# EAGLE schematic Elspark v6 (EAGLE 6.5.0)
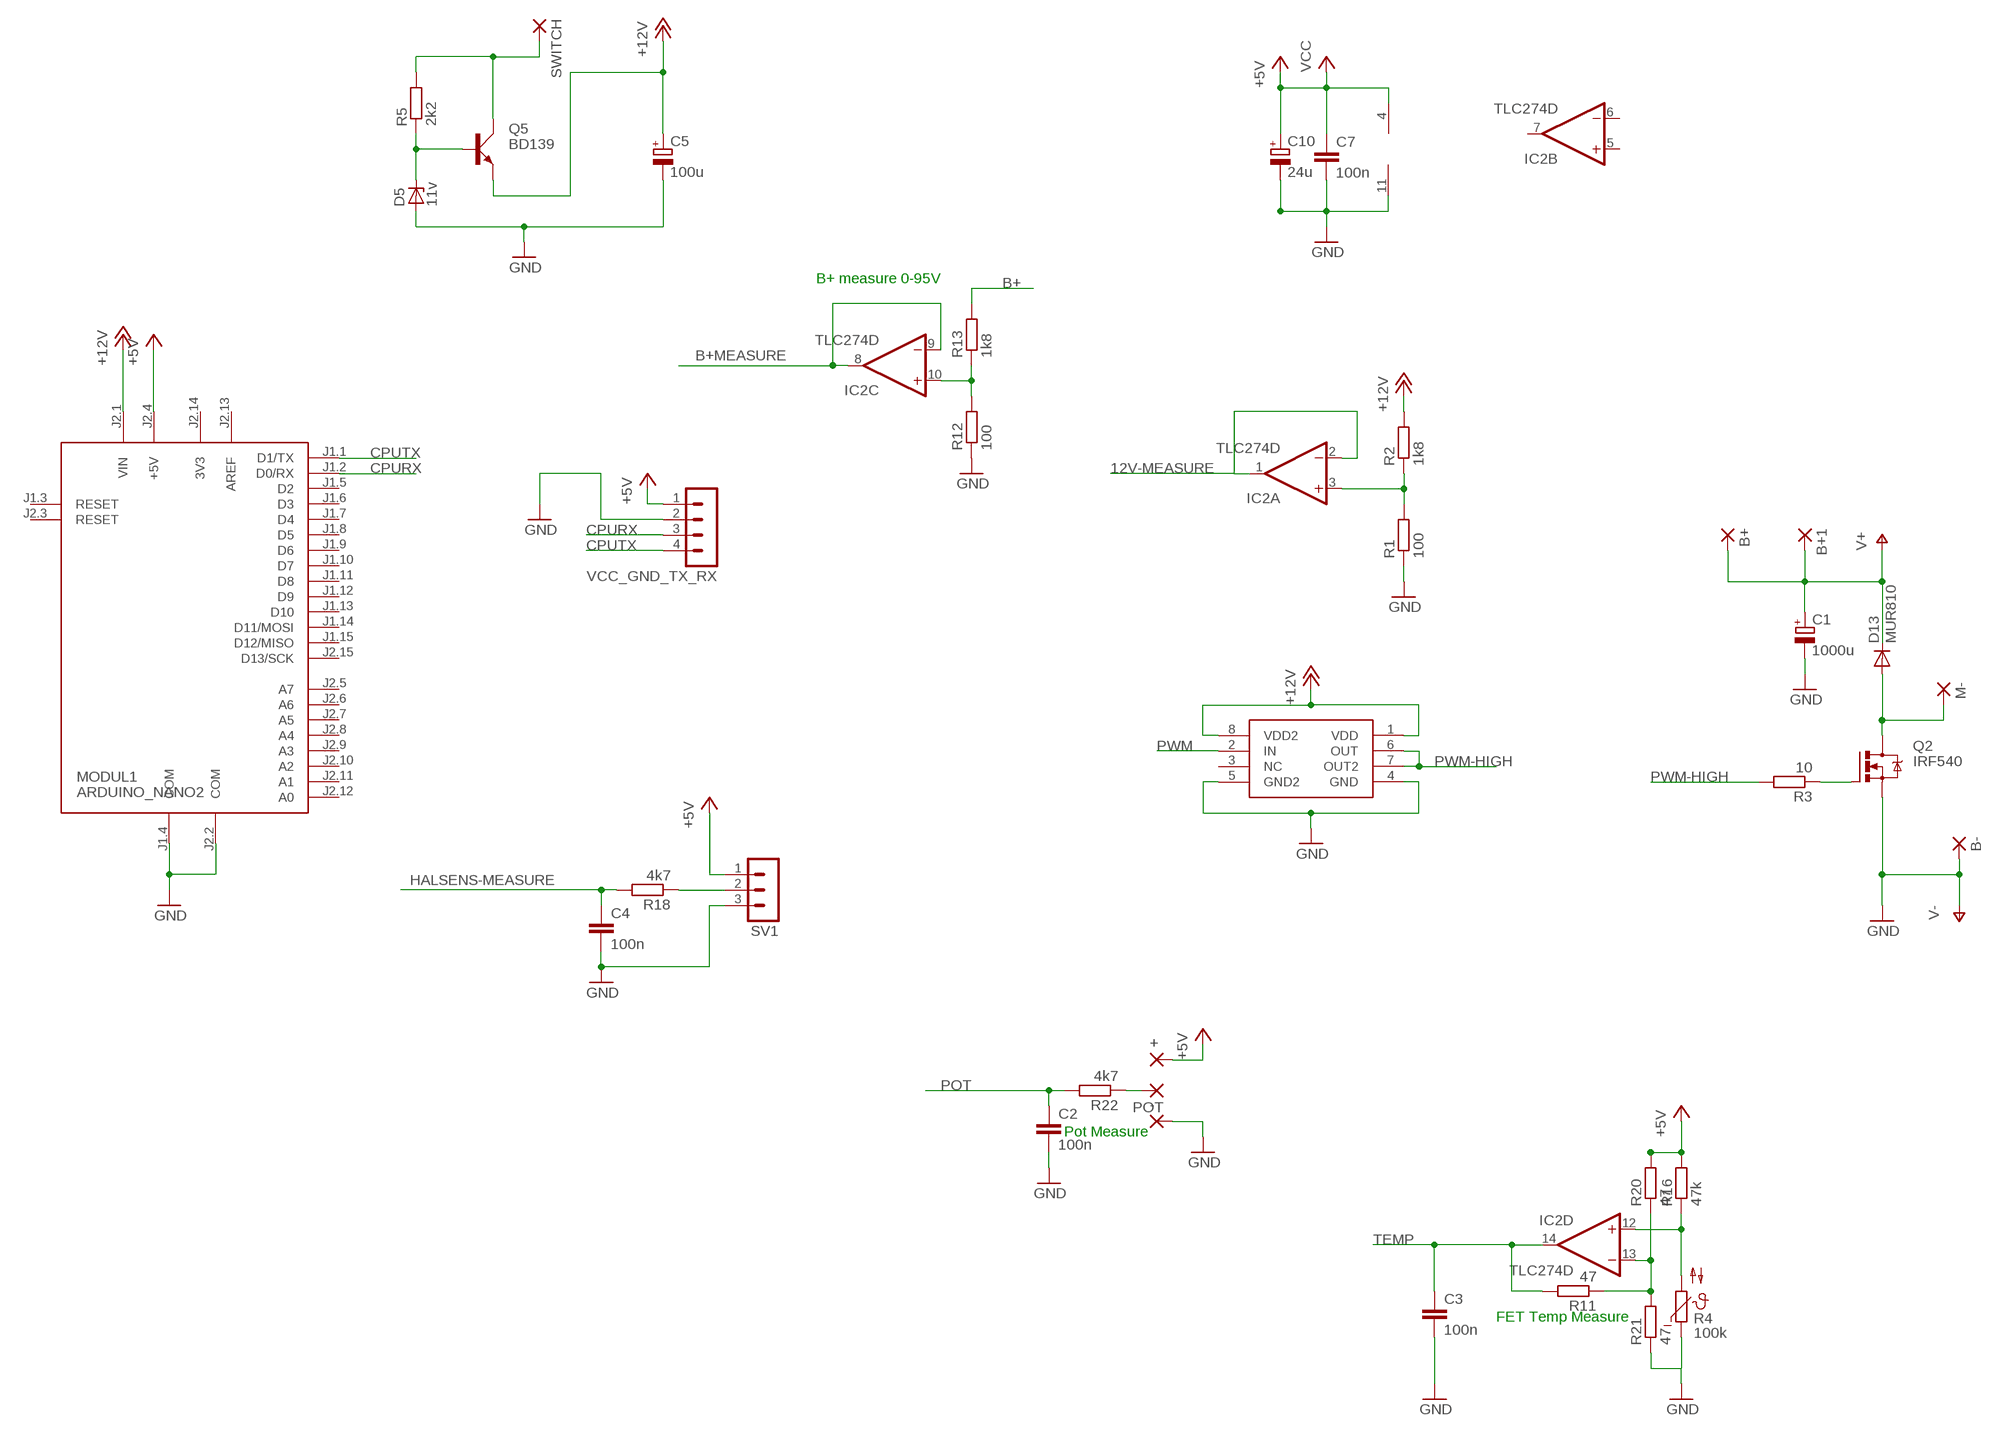
[diagram p0: schematic, sheet 1]

## Parts
+  2,15/1,0  [2,15/1,0]
-  2,15/1,0  [2,15/1,0]
B+  WIREPAD4,16O1,6  [4,16O1,6]
B+1  WIREPAD4,16O1,6  [4,16O1,6]
B-  WIREPAD4,16O1,6  [4,16O1,6]
C1  1000u  CPOL-EUE7.5-16  [E7,5-16]
C2  100n  C-EU050-024X044  [C050-024X044]
C3  100n  C-EU050-024X044  [C050-024X044]
C4  100n  C-EU050-024X044  [C050-024X044]
C5  100u  CPOL-EUE2.5-5  [E2,5-5]
C7  100n  C-EU050-024X044  [C050-024X044]
C10  24u  CPOL-EUE2.5-5  [E2,5-5]
D5  11v  BZX55  [DO35Z10]
D13  MUR810  [TO220ACS]
IC2  TLC274D  [SO14]
M-  WIREPAD4,16O1,6  [4,16O1,6]
MODUL1  ARDUINO_NANO2  [ARDUINO_NANO2]
POT  2,15/1,0  [2,15/1,0]
Q2  IRF540  [TO220BV]
Q5  BD139  [TO126AV]
R1  100  R-EU_0204/7  [0204/7]
R2  1k8  R-EU_0204/7  [0204/7]
R3  10  R-EU_0207/2V  [0207/2V]
R4  100k  NTC640-9  [N640]
R5  2k2  R-EU_0207/2V  [0207/2V]
R11  47  R-EU_0207/2V  [0207/2V]
R12  100  R-EU_0204/7  [0204/7]
R13  1k8  R-EU_0204/7  [0204/7]
R16  47k  R-EU_0207/2V  [0207/2V]
R18  4k7  R-EU_0204/7  [0204/7]
R20  47  R-EU_0207/2V  [0207/2V]
R21  47  R-EU_0207/2V  [0207/2V]
R22  4k7  R-EU_0207/2V  [0207/2V]
SV1  MA03-1  [MA03-1]
SWITCH  1,6/0,9  [1,6/0,9]
U$1  MIC4451SO-8  [SO-8]
VCC_GND_TX_RX  MA04-1  [MA04-1]

## Nets
12V-MEASURE: IC2.1(A:OUT) IC2.2(A:-IN)
+5V: MODUL1.J2.4(+5V) R16.2 R20.2 SV1.1 VCC_GND_TX_RX.1
+12V [Power]: C5.+ MODUL1.J2.1(VIN) Q5.E R2.2 U$1.1(VDD) U$1.8(VDD2)
B+ [High Power]: B+1.1(P) B+.1(P) C1.+ D13.C R13.2 ; supply symbol labelled V+
B+MEASURE: IC2.8(C:OUT) IC2.9(C:-IN)
CPURX: MODUL1.J1.2(D0/RX) VCC_GND_TX_RX.3
CPUTX: MODUL1.J1.1(D1/TX) VCC_GND_TX_RX.4
GND [Power]: -.1(P) B-.1(P) C1.- C2.2 C3.2 C4.2 C5.- C7.2 C10.- D5.A IC2.11(P:V-) MODUL1.J1.4(COM) MODUL1.J2.2(COM) Q2.S R1.1 R4.1 R12.1 R21.1 SV1.3 U$1.4(GND) U$1.5(GND2) VCC_GND_TX_RX.2 ; supply symbol labelled V-
HALSENS-MEASURE: C4.1 R18.2
M+ [High Power]: D13.A M-.1(P) Q2.D
N$2: IC2.3(A:+IN) R1.2 R2.1
N$9: Q2.G R3.1
N$10: IC2.10(C:+IN) R12.2 R13.1
N$11: D5.C Q5.B R5.1
N$17: R18.1 SV1.2
N$23: IC2.13(D:-IN) R11.1 R20.1 R21.2
N$34: POT.1(P) R22.1
N$35: IC2.12(D:+IN) R4.2 R16.1
N$41 [Power]: Q5.C R5.2 SWITCH.1(P)
POT: C2.1 R22.2
PWM: U$1.2(IN)
PWM-HIGH: R3.2 U$1.6(OUT) U$1.7(OUT2)
TEMP: C3.1 IC2.14(D:OUT) R11.2
VCC: +.1(P) C7.1 C10.+ IC2.4(P:V+) ; supply symbol labelled +5V
Unconnected: IC2.5(B:+IN) IC2.6(B:-IN) IC2.7(B:OUT) MODUL1.J1.3(RESET) MODUL1.J1.5(D2) MODUL1.J1.6(D3) MODUL1.J1.7(D4) MODUL1.J1.8(D5) MODUL1.J1.9(D6) MODUL1.J1.10(D7) MODUL1.J1.11(D8) MODUL1.J1.12(D9) MODUL1.J1.13(D10) MODUL1.J1.14(D11/MOSI) MODUL1.J1.15(D12/MISO) MODUL1.J2.3(RESET) MODUL1.J2.5(A7) MODUL1.J2.6(A6) MODUL1.J2.7(A5) MODUL1.J2.8(A4) MODUL1.J2.9(A3) MODUL1.J2.10(A2) MODUL1.J2.11(A1) MODUL1.J2.12(A0) MODUL1.J2.15(D13/SCK) U$1.3(NC)

## Notes on the sheet
- B+ measure 0-95V
- Pot Measure
- FET Temp Measure

## Power pins joined to a net without a drawn wire
3V3: MODUL1.J2.14(3V3)
AREF: MODUL1.J2.13(AREF)

## Library data of the parts
+ - POT = wirepad:2,15/1,0: THROUGH-HOLE PAD
B+ B+1 B- M- = wirepad:WIREPAD: Wire PAD connect wire on PCB
C1 C5 C10 = rcl:CPOL-EU: POLARIZED CAPACITOR, European symbol
C2-C4 C7 = rcl:C-EU: CAPACITOR, European symbol
D5 = diode:BZX55: Z DIODE
D13 = diode:MUR810: DIODE
IC2 = linear:TLC274: OP AMP
MODUL1 = arduino:ARDUINO_NANO2: Arduino Nano2 Auto generated by modulcreator.ulp \;; ANZAHL: 2; MODUL: TRUE; STECKX0: -76200; STECKX1: 76200; STECKY0: 177800; STECKY1: 177800
Q2 = transistor-power:IRF540: HEXFET Power MOSFET
Q5 = transistor-power:BD139: NPN TRANSISTOR
R1-R3 R5 R11-R13 R16 R18 R20-R22 = rcl:R-EU_: RESISTOR, European symbol
R4 = ptc-ntc:NTC640-9: PHILIPS NTC
SV1 = con-lstb:MA03-1: PIN HEADER; OC_FARNELL: unknown; OC_NEWARK: unknown
SWITCH = wirepad:1,6/0,9: THROUGH-HOLE PAD
U$1 = mic4451:MIC4451
VCC_GND_TX_RX = con-lstb:MA04-1: PIN HEADER; OC_FARNELL: unknown; OC_NEWARK: unknown

## Net classes
1 Power: width 1 mm, drill 1 mm
2 High Power: width 2 mm, drill 2 mm